# Altium schematic sheet CONTROL_AND_COMMUNICATION.SchDoc
size A4
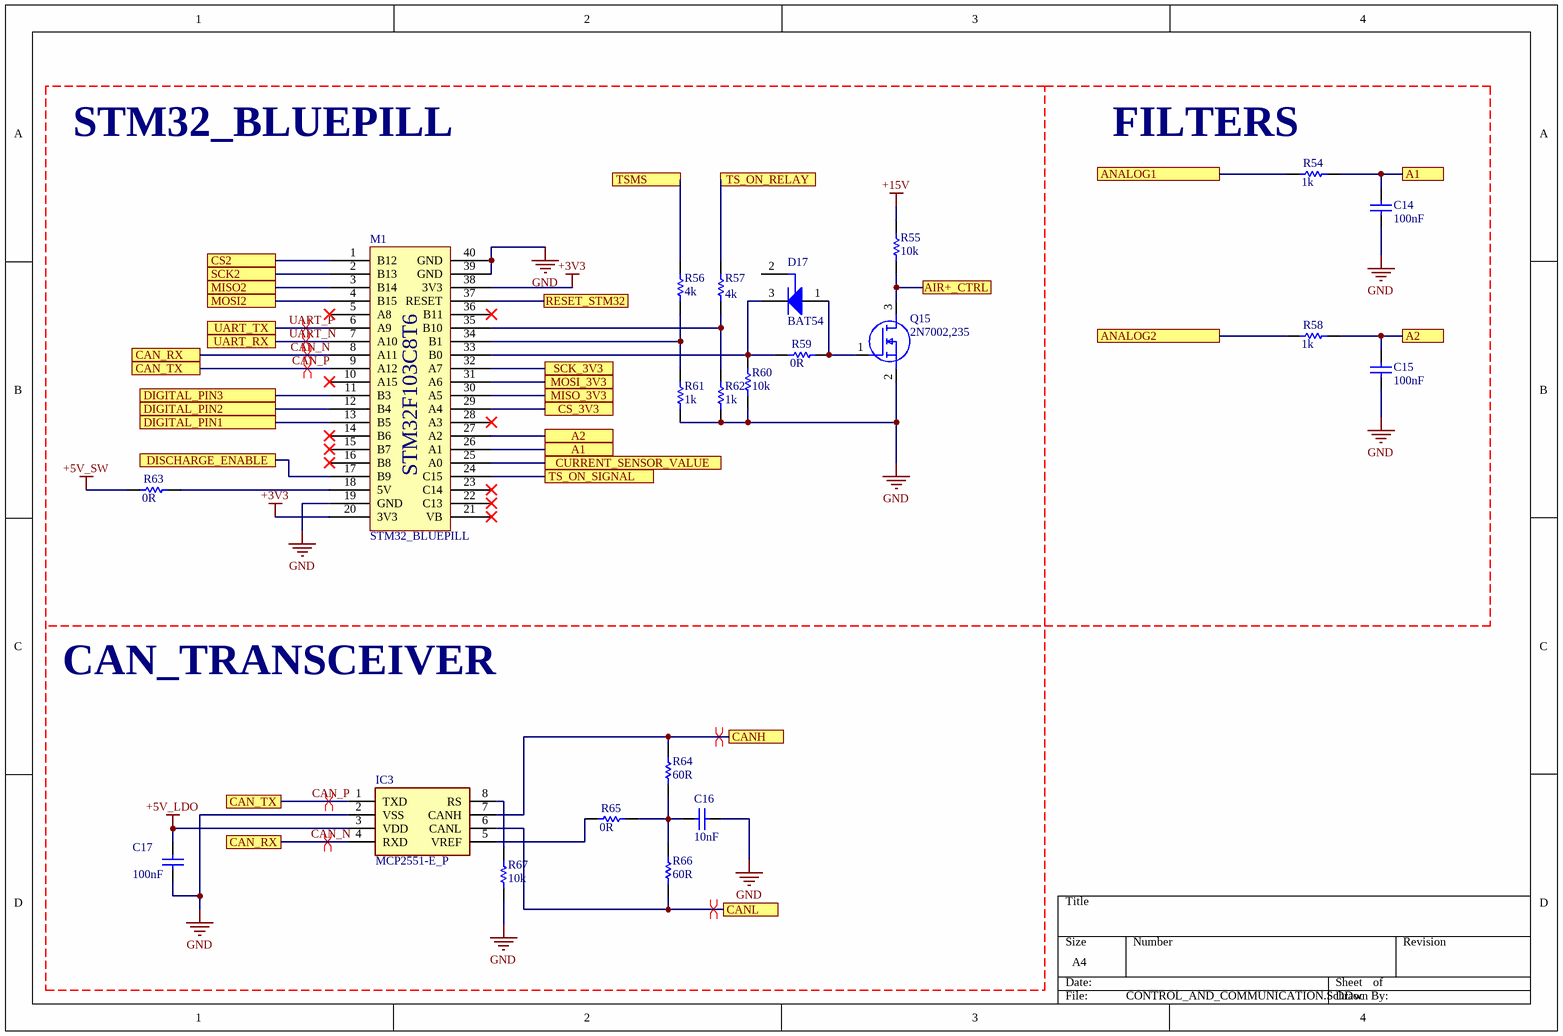
[diagram p0: CONTROL_AND_COMMUNICATION.SchDoc]

## Parts
C14  100nF  [KEMT-1206-2_N]
C15  100nF  [KEMT-1206-2_N]
C16  10nF  [KEMT-1206-2_N]
C17  100nF  [KEMT-1206-2_N]
D17  BAT54  [INF-SOT23_N]
IC3  MCP2551-E_P  [DIP794W56P254L946H432Q8N]
M1  STM32_BLUEPILL  [stm32_bluepill]
Q15  2N7002,235  [SOT95P230X110-3N]
R54  1k  [RESC3216X60X45NL10T20 - duplicate]
R55  10k  [RESC3216X60X45NL10T20 - duplicate]
R56  4k  [RESC3216X60X45NL10T20 - duplicate]
R57  4k  [RESC3216X60X45NL10T20 - duplicate]
R58  1k  [RESC3216X60X45NL10T20 - duplicate]
R59  0R  [RESC3216X60X45NL10T20 - duplicate]
R60  10k  [RESC3216X60X45NL10T20 - duplicate]
R61  1k  [RESC3216X60X45NL10T20 - duplicate]
R62  1k  [RESC3216X60X45NL10T20 - duplicate]
R63  0R  [RESC3216X60X45NL10T20 - duplicate]
R64  60R  [RESC3216X60X45NL10T20 - duplicate]
R65  0R  [RESC3216X60X45NL10T20 - duplicate]
R66  60R  [RESC3216X60X45NL10T20 - duplicate]
R67  10k  [RESC3216X60X45NL10T20 - duplicate]

## Ports
A1, A2, AIR+_CTRL, ANALOG1, ANALOG2, CAN_RX, CAN_TX, CANH, CANL, CS2, CS_3V3, CURRENT_SENSOR_VALUE, DIGITAL_PIN1, DIGITAL_PIN2, DIGITAL_PIN3, DISCHARGE_ENABLE, MISO2, MISO_3V3, MOSI2, MOSI_3V3, RESET_STM32, SCK2, SCK_3V3, TS_ON_RELAY, TS_ON_SIGNAL, TSMS, UART_RX, UART_TX

## Nets
+3V3: M1.20(3V3) M1.38(3V3)
+5V_LDO: C17.1 IC3.3(VDD)
+5V_SW: R63.2
+15V: R55.1
GND: C14.2 C15.2 C16.2 C17.2 IC3.2(VSS) M1.19(GND) M1.39(GND) M1.40(GND) Q15.2(S) R60.2 R61.2 R62.2 R67.2
A1: C14.1 M1.26(A1) R54.1 ; port A1
A2: C15.1 M1.27(A2) R58.1 ; port A2
AIR+_CTRL: Q15.3(D) R55.2 ; port AIR+_CTRL
ANALOG1: R54.2 ; port ANALOG1
ANALOG2: R58.2 ; port ANALOG2
CAN_N: IC3.4(RXD) M1.8(A11) ; port CAN_RX
CAN_P: IC3.1(TXD) M1.9(A12) ; port CAN_TX
CANH: IC3.7(CANH) R64.2 ; port CANH
CANL: IC3.6(CANL) R66.2 ; port CANL
CS2: M1.1(B12) ; port CS2
CS_3V3: M1.29(A4) ; port CS_3V3
CURRENT_SENSOR_VALUE: M1.25(A0) ; port CURRENT_SENSOR_VALUE
DIGITAL_PIN1: M1.13(B5) ; port DIGITAL_PIN1
DIGITAL_PIN2: M1.12(B4) ; port DIGITAL_PIN2
DIGITAL_PIN3: M1.11(B3) ; port DIGITAL_PIN3
DISCHARGE_ENABLE: M1.17(B9) ; port DISCHARGE_ENABLE
MISO2: M1.3(B14) ; port MISO2
MISO_3V3: M1.30(A5) ; port MISO_3V3
MOSI2: M1.4(B15) ; port MOSI2
MOSI_3V3: M1.31(A6) ; port MOSI_3V3
RESET_STM32: M1.37(RESET) ; port RESET_STM32
SCK2: M1.2(B13) ; port SCK2
SCK_3V3: M1.32(A7) ; port SCK_3V3
TS_ON_RELAY: R57.1 ; port TS_ON_RELAY
TS_ON_SIGNAL: M1.24(C15) ; port TS_ON_SIGNAL
TSMS: R56.1 ; port TSMS
UART_N: M1.7(A10) ; port UART_RX
UART_P: M1.6(A9) ; port UART_TX
NetC16_1: C16.1 R64.1 R65.1 R66.1
NetD17_1: D17.1(A) Q15.1(G) R59.1
NetD17_3: D17.3(K) M1.33(B0) R59.2 R60.1
NetIC3_5: IC3.5(VREF) R65.2
NetIC3_8: IC3.8(RS) R67.1
NetM1_18: M1.18(5V) R63.1
NetM1_34: M1.34(B1) R56.2 R61.1
NetM1_35: M1.35(B10) R57.2 R62.1

Not connected (* = marked no-connect by the designer): D17 2(NC); M1 5(A8)* 10(A15)* 14(B6)* 15(B7)* 16(B8)* 21(VB)* 22(C13)* 23(C14)* 28(A3)* 36(B11)*

## Layout directives
differential pair: CAN_N, CAN_P, CANH, CANL, UART_N, UART_P

## Notes on the sheet
- STM32_BLUEPILL
- (near R54) FILTERS
- CAN_TRANSCEIVER
- (in symbol stm32_bluepill) STM32F103C8T6

## Library data of the parts
C14-C17 = CMP-1037-04202-2: CAP, Ceramic, 0.1 uF, +/- 10%, 50 V, -55 to 125 degC, 1206 (3216 Metric), RoHS, Tape and Reel; Manufacturer: Kemet; Voltage Rating: 50V; Capacitance: 0.1µF; Product Range: KEMET-CSeries; SVHC: ToBeAdvised; Dielectric Characteristic: X7R; Capacitor Case Style: 1206[3216Metric]; Package Reference: 1206-2; Package Description: 2-Leads SMD, Body 3.2 x 1.6 mm; Packaging: Tape&Reel; Operating Temperature Max: 125degC; Capacitance Tolerance: ±10%; Datasheet URL: https://datasheet.ciiva.com/6125/1725438-6125494.pdf; Manufacturer URL: http://www.kemet.com/; Operating Temperature Min: -55degC; Datasheet Version: Jul-13
D17 = CMP-1182-00010-1: Silicon Schottky Diode, SOT23, Reel, Green; Manufacturer: Infineon; VF (max): 800Â mV; Configuration: Single; IF (max): 200Â mA; CT (max): 10Â pF; Green: TRUE; VR (max): 30Â V; PartNumber: BAT54; ComponentLink2URL: http://www.infineon.com/dgdl/bat54series.pdf?folderId=db3a30431400ef68011425f1ca2505e3&fileId=db3a304314dca3890115190b74210ea6; ComponentLink3Description: Package Specification; PackageVersion: Apr-08; PackageDescription: 3-Pin Small Outline Transistor Package, 1.3 x 2.9 mm Body, 0.95 mm Pitch; ComponentLink1Description: Manufacturer URL; ComponentLink1URL: http://www.infineon.com/; Mounting Technology: Surface Mount; Packing: Reel; ComponentLink2Description: Datasheet; PackageReference: SOT23; ComponentLink3URL: http://www.infineon.com/dgdl/SOT23-Package_Overview.pdf?folderId=db3a30431936bc4b0119532290053c66&fileId=db3a30431936bc4b0119533468123c85
IC3 = MCP2551-E_P: Integrated Circuit; Manufacturer_Name: Microchip; Manufacturer_Part_Number: MCP2551-E/P; Datasheet Link: http://componentsearchengine.com/Datasheets/1/MCP2551-E_P.pdf; Height: 4.32mm; Mouser Part Number: 579-MCP2551-E/P; Mouser Price/Stock: https://www.mouser.co.uk/ProductDetail/Microchip-Technology/MCP2551-E-P?qs=0st6i8lJel5By%2FScxOd%2FTw%3D%3D; Arrow Part Number: MCP2551-E/P; Arrow Price/Stock: https://www.arrow.com/en/products/mcp2551-ep/microchip-technology?region=nac
Q15 = 2N7002,235: MOSFET (N-Channel); Manufacturer_Name: Nexperia; Datasheet Link: https://assets.nexperia.com/documents/data-sheet/2N7002.pdf; Height: 1.1mm; Manufacturer_Part_Number: 2N7002,235; Mouser Part Number: 771-2N7002235; Mouser Price/Stock: https://www.mouser.co.uk/ProductDetail/Nexperia/2N7002235?qs=AX3SRYwdf7Gv59FeQZ%2FkYw%3D%3D; Arrow Part Number: 2N7002,235; Arrow Price/Stock: https://www.arrow.com/en/products/2n7002235/nexperia
R54-R67 = CMP-2003-02213-1: Part Number: CRCW120647K0FKEA; Manufacturer: Vishay Dale